# Altium schematic sheet LIMITSWITCH_SCH.SchDoc
size A; SheetNumber: 1; SheetTotal: 1
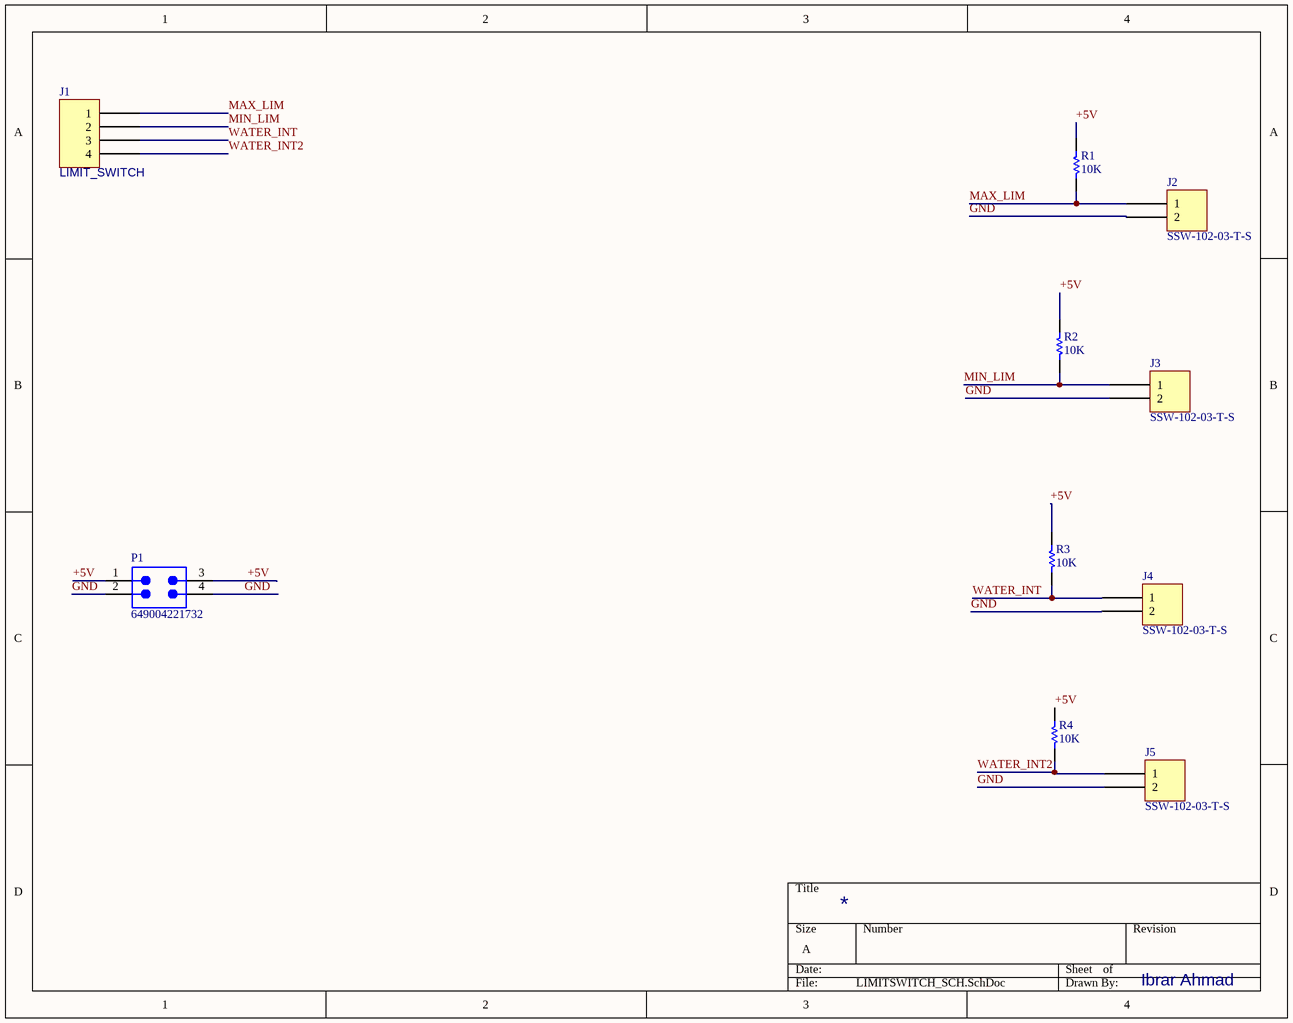
[diagram p0: LIMITSWITCH_SCH.SchDoc]

## Parts
J1  LIMIT_SWITCH  [MOLEX 395021004]
J2  SSW-102-03-T-S  [SAMTEC SSW-102-03-T-S]
J3  SSW-102-03-T-S  [SAMTEC SSW-102-03-T-S]
J4  SSW-102-03-T-S  [SAMTEC SSW-102-03-T-S]
J5  SSW-102-03-T-S  [SAMTEC SSW-102-03-T-S]
P1  649004221732  [649004221732]
R1  RESISTANCE: 10K  [RESC3215X60X61NL15T15]  (hidden comment: CRA06E08310K0JTA)
R2  RESISTANCE: 10K  [RESC3215X60X61NL15T15]  (hidden comment: CRA06E08310K0JTA)
R3  RESISTANCE: 10K  [RESC3215X60X61NL15T15]  (hidden comment: CRA06E08310K0JTA)
R4  RESISTANCE: 10K  [RESC3215X60X61NL15T15]  (hidden comment: CRA06E08310K0JTA)

## Nets
+5V: P1.1 P1.3 R1.2 R2.2 R3.2 R4.2
GND: J2.2 J3.2 J4.2 J5.2 P1.2 P1.4
MAX_LIM: J1.1 J2.1 R1.1
MIN_LIM: J1.2 J3.1 R2.1
WATER_INT: J1.3 J4.1 R3.1
WATER_INT2: J1.4 J5.1 R4.1

## Notes on the sheet
- Ibrar Ahmad

## Library data of the parts
J1 = 0395021004: TERM BLOCK HDR 4POS 90DEG 3.5MM; Manufacturer: Molex; Current - UL: 8A; Header Orientation: 90°, Right Angle; Number of Levels: 1; Number of Positions: 4; Pitch: 0.138" (3.50mm); Voltage - UL: 300V; Part Number: 0395021004; Color: Black; ComponentLink1Description: Datasheet; ComponentLink1URL: https://www.molex.com/pdm_docs/sd/395021002_sd.pdf; ComponentLink2Description: DigiKey Link; ComponentLink2URL: http://digikey.com/product-detail/en/molex/0395021004/WM7772-ND/1280623; Contact Mating Finish: Tin; LastUpdated: 6/25/2020 3:44:36 PM; Lifecycle Status: Active; Minimum Order: 1; Mounting Type: Through Hole; Operating Temperature: -40°C ~ 105°C; Packaging: Tray; Part Status: Active; Positions Per Level: 4; Price: 1.07; Series: Eurostyle ESE 39502; Supplier 1: DigiKey; Supplier Part Number 1: WM7772-ND; Termination Style: Solder; Type: Header, Male Pins, Shrouded (4 Side)
J2-J5 = SSW-102-03-T-S: CONN RCPT 2POS 0.1 TIN PCB; Manufacturer: Samtec Inc.; Connector Type: Receptacle; Current Rating (Amps): 5.7A per Contact; Material Flammability Rating: UL94 V-0; Number of Positions: 2; Number of Positions Loaded: All; Style: Board to Board or Cable; Part Number: SSW-102-03-T-S; ComponentLink2Description: DigiKey Link; ComponentLink2URL: http://digikey.com/product-detail/en/samtec-inc/SSW-102-03-T-S/SSW-102-03-T-S-ND/7873010; Contact Finish - Mating: Tin; Contact Finish - Post: Tin; Contact Type: Forked; Fastening Type: Push-Pull; Insulation Color: Black; LastUpdated: 6/21/2022 3:06:02 PM; Lifecycle Status: Active; Minimum Order: 1; Mounting Type: Through Hole; Number of Rows: 1; Operating Temperature: -55°C ~ 105°C; Packaging: Bulk; Part Status: Active; Price: 0.53; Series: SSW; Supplier 1: DigiKey; Supplier Part Number 1: SSW-102-03-T-S-ND; Termination: Solder
P1 = CMP-1502-00506-2: NexarPartId: 23024601; Current Rating: 8A; Contact Resistance: 10mΩ; Gender: Male; Number of Contacts: 4; Insulation Resistance: 1GΩ; Row Spacing: 4.191mm; Operating Supply Voltage: 600V; Connector Type: Male Pin, Plug; Pitch: 4.2mm; Number of Pins: 4; Width: 9.6mm; Lead Pitch: 4.2mm; REACH SVHC: Unknown; Orientation: Vertical; Length: 9.6mm; Max Operating Temperature: 105°C; Min Operating Temperature: -40°C; Color: White; Contact Material: Copper; Termination: Solder; RoHS: Compliant; Fastening Type: Ramp; Contact Plating: Tin; Number of Positions: 4; Mount: Through Hole; Number of Rows: 2; Height: 12.8mm
R1-R4 = CMP-2003-04858-1: Manufacturer: Vishay Dale; Part Number: CRA06E08310K0JTA; Parameter 1: *